# Altium schematic sheet OCU_BuckChannel_r3.SchDoc
size A4
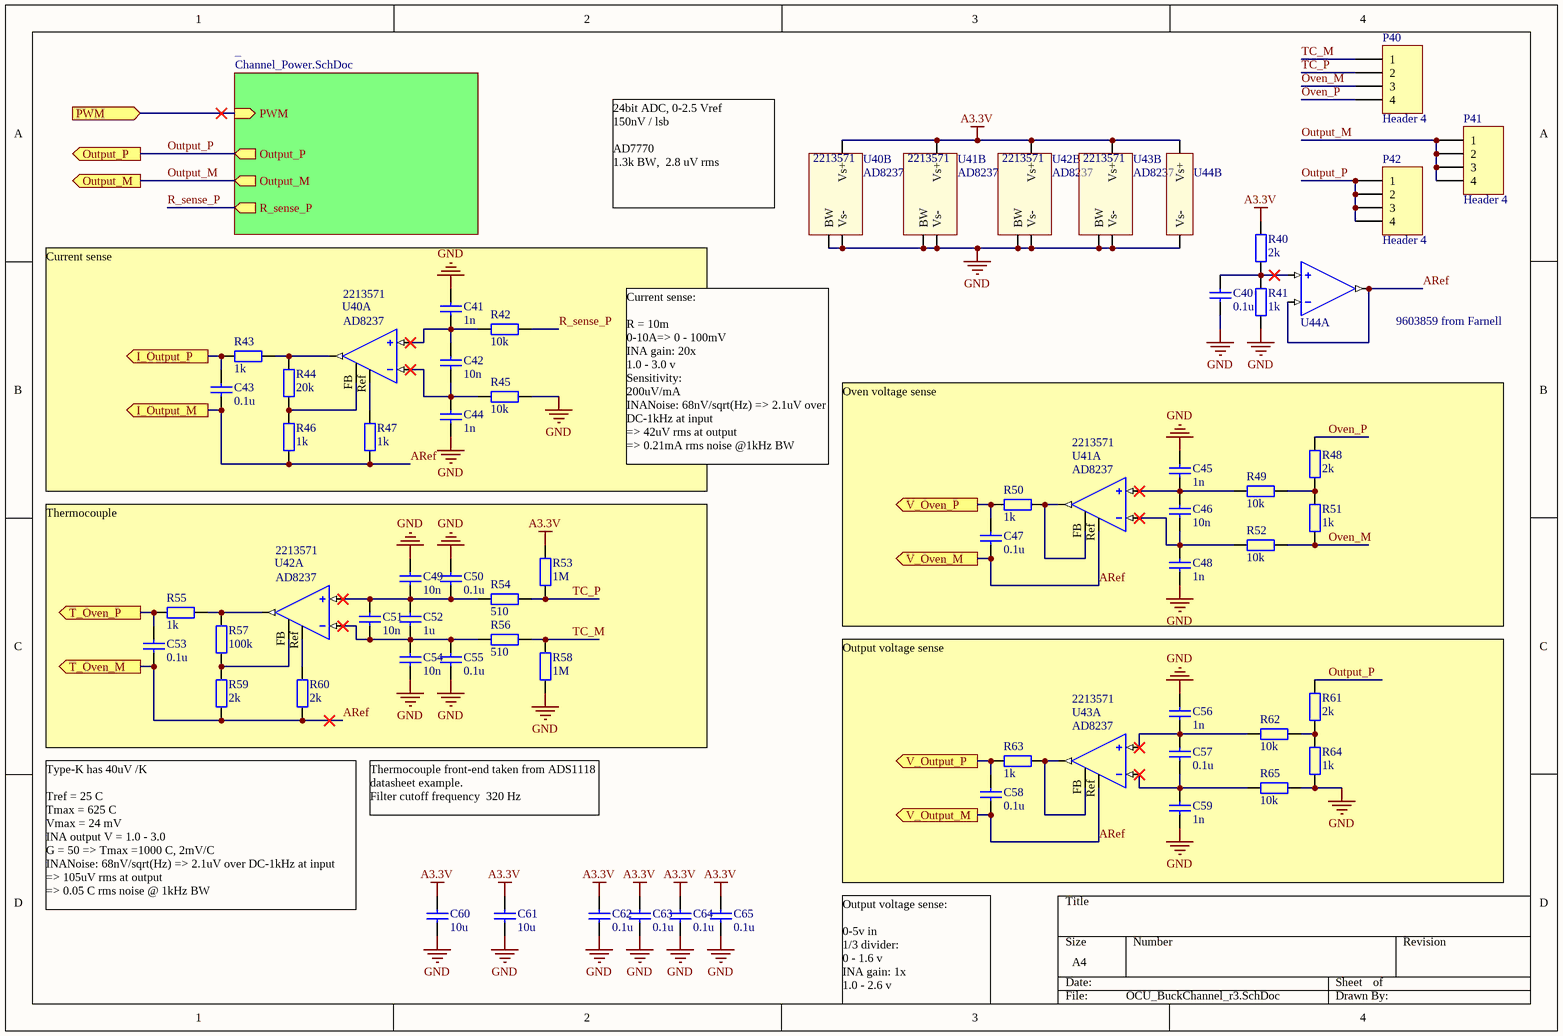
[diagram p0: OCU_BuckChannel_r3.SchDoc]

## Parts
C40  0.1u  [CAPC1608M]
C41  1n  [CAPC1608M]
C42  10n  [CAPC1608M]
C43  0.1u  [CAPC1608M]
C44  1n  [CAPC1608M]
C45  1n  [CAPC1608M]
C46  10n  [CAPC1608M]
C47  0.1u  [CAPC1608M]
C48  1n  [CAPC1608M]
C49  10n  [CAPC1608M]
C50  0.1u  [CAPC1608M]
C51  10n  [CAPC1608M]
C52  1u  [CAPC1608M]
C53  0.1u  [CAPC1608M]
C54  10n  [CAPC1608M]
C55  0.1u  [CAPC1608M]
C56  1n  [CAPC1608M]
C57  0.1u  [CAPC1608M]
C58  0.1u  [CAPC1608M]
C59  1n  [CAPC1608M]
C60  10u  [CAPC2012M]
C61  10u  [CAPC2012M]
C62  0.1u  [CAPC1608M]
C63  0.1u  [CAPC1608M]
C64  0.1u  [CAPC1608M]
C65  0.1u  [CAPC1608M]
P40  Header 4  [HDR1X4]
P41  Header 4  [HDR1X4]
P42  Header 4  [HDR1X4]
R40  2k  [RESC1608M]
R41  1k  [RESC1608M]
R42  10k  [RESC1608M]
R43  1k  [RESC1608M]
R44  20k  [RESC1608M]
R45  10k  [RESC1608M]
R46  1k  [RESC1608M]
R47  1k  [RESC1608M]
R48  2k  [RESC1608M]
R49  10k  [RESC1608M]
R50  1k  [RESC1608M]
R51  1k  [RESC1608M]
R52  10k  [RESC1608M]
R53  1M  [RESC1608M]
R54  510  [RESC1608M]
R55  1k  [RESC1608M]
R56  510  [RESC1608M]
R57  100k  [RESC1608M]
R58  1M  [RESC1608M]
R59  2k  [RESC1608M]
R60  2k  [RESC1608M]
R61  2k  [RESC1608M]
R62  10k  [RESC1608M]
R63  1k  [RESC1608M]
R64  1k  [RESC1608M]
R65  10k  [RESC1608M]
U40  AD8237  Supplier Part Number 1: 2213571  [TSOP65P490-8AM]  (parts A,B of 2)
U41  AD8237  Supplier Part Number 1: 2213571  [TSOP65P490-8AM]  (parts A,B of 2)
U42  AD8237  Supplier Part Number 1: 2213571  [TSOP65P490-8AM]  (parts A,B of 2)
U43  AD8237  Supplier Part Number 1: 2213571  [TSOP65P490-8AM]  (parts A,B of 2)
U44  OpAmp  [SOIC127P600-8M]  (value not drawn)  (parts A,B of 2)

## Sub-sheets
_ = Channel_Power.SchDoc: PWM (in), Output_P (out), Output_M (out), R_sense_P (out)

## Ports
I_Output_M (out), I_Output_P (out), Output_M (out), Output_P (out), PWM (in), T_Oven_M (out), T_Oven_P (out), V_Output_M (out), V_Output_P (out), V_Oven_M (out), V_Oven_P (out)

## Nets
A3.3V: C60.1 C61.1 C62.1 C63.1 C64.1 C65.1 R40.2 R53.2 U40.Vs+ U41.Vs+ U42.Vs+ U43.Vs+ U44.Vs+
GND: C40.2 C41.1 C44.2 C45.1 C48.2 C49.1 C50.1 C54.2 C55.2 C56.1 C59.2 C60.2 C61.2 C62.2 C63.2 C64.2 C65.2 R41.1 R45.2 R58.1 R64.1 R65.2 U40.BW U40.Vs- U41.BW U41.Vs- U42.BW U42.Vs- U43.BW U43.Vs- U44.Vs-
ARef: C43.2 C47.2 C53.2 C58.2 R46.1 R47.1 R59.1 R60.1 U41.Ref U43.Ref U44.In-(-) U44.Out ; port T_Oven_M, port I_Output_M, port V_Output_M, port V_Oven_M
I_Output_P: C43.1 R43.2 ; port I_Output_P
Output_M: P41.1 P41.2 P41.3 P41.4 ; port Output_M, sheet _/Output_M
Output_P: P42.1 P42.2 P42.3 P42.4 R61.2 ; port Output_P, sheet _/Output_P
Oven_M: P40.3 R51.1 R52.2
Oven_P: P40.4 R48.2
PWM: port PWM, sheet _/PWM
R_sense_P: R42.2 ; sheet _/R_sense_P
T_Oven_P: C53.1 R55.2 ; port T_Oven_P
TC_M: P40.1 R56.1 R58.2
TC_P: P40.2 R53.1 R54.1
V_Output_P: C58.1 R63.2 ; port V_Output_P
V_Oven_P: C47.1 R50.2 ; port V_Oven_P
NetC40_1: C40.1 R40.1 R41.2 U44.In+(+)
NetC41_2: C41.2 C42.1 R42.1 U40.In+(+)
NetC42_2: C42.2 C44.1 R45.1 U40.In-(-)
NetC45_2: C45.2 C46.1 R49.1 U41.In+(+)
NetC46_2: C46.2 C48.1 R52.1 U41.In-(-)
NetC49_2: C49.2 C50.2 C51.1 C52.1 R54.2 U42.In+(+)
NetC51_2: C51.2 C52.2 C54.1 C55.1 R56.2 U42.In-(-)
NetC56_2: C56.2 C57.1 R62.1 U43.In+(+)
NetC57_2: C57.2 C59.1 R65.1 U43.In-(-)
NetR43_1: R43.1 R44.2 U40.Out
NetR44_1: R44.1 R46.2 U40.FB
NetR47_2: R47.2 U40.Ref
NetR48_1: R48.1 R49.2 R51.2
NetR50_1: R50.1 U41.FB U41.Out
NetR55_1: R55.1 R57.2 U42.Out
NetR57_1: R57.1 R59.2 U42.FB
NetR60_2: R60.2 U42.Ref
NetR61_1: R61.1 R62.2 R64.2
NetR63_1: R63.1 U43.FB U43.Out

## Notes on the sheet
- 24bit ADC, 0-2.5 Vref
  150nV / lsb
  AD7770
  1.3k BW,  2.8 uV rms
- (near U44) 9603859 from Farnell
- Current sense
- Current sense:
  R = 10m
  0-10A=> 0 - 100mV
  INA gain: 20x
  1.0 - 3.0 v
  Sensitivity:
  200uV/mA
  INANoise: 68nV/sqrt(Hz) => 2.1uV over DC-1kHz at input
  => 42uV rms at output
  => 0.21mA rms noise @1kHz BW
- Oven voltage sense
- Thermocouple
- Thermocouple front-end taken from ADS1118 datasheet example.
  Filter cutoff frequency  320 Hz
- Type-K has 40uV /K
  Tref = 25 C
  Tmax = 625 C
  Vmax = 24 mV
  INA output V = 1.0 - 3.0
  G = 50 => Tmax =1000 C, 2mV/C
  INANoise: 68nV/sqrt(Hz) => 2.1uV over DC-1kHz at input
  => 105uV rms at output
  => 0.05 C rms noise @ 1kHz BW
- Output voltage sense
- Output voltage sense:
  0-5v in
  1/3 divider:
  0 - 1.6 v
  INA gain: 1x
  1.0 - 2.6 v

## Library data of the parts
C40-C65 = C
  C40 C43 C47 C50 C53 C55 C57 C58 C62-C65: Value: 0.1u
  C41 C44 C45 C48 C56 C59: Value: 1n
  C42 C46 C49 C51 C54: Value: 10n
  C52: Value: 1u
  C60 C61: Value: 10u
P40-P42 = Header 4: Header, 4-Pin; LatestRevisionDate: 17-Jul-2002; LatestRevisionNote: Re-released for DXP Platform.; Publisher: Altium Limited
R40-R65 = R
  R40 R48 R59-R61: Value: 2k
  R41 R43 R46 R47 R50 R51 R55 R63 R64: Value: 1k
  R42 R45 R49 R52 R62 R65: Value: 10k
  R44: Value: 20k
  R53 R58: Value: 1M
  R54 R56: Value: 510
  R57: Value: 100k
U40-U43 = AD8237: Instrumentation Amplifier; pin to pad: BW>1 FB>7 In+>2 In->3 Out>8 Ref>6 Vs+>5 Vs->4; Supplier 1: Farnell
U44 = OpAmp: Generic Op Amp; pin to pad: In+>3 In->2 Out>6 Vs+>7 Vs->4